# EAGLE schematic esp8266S_5A (EAGLE 7.5.0)
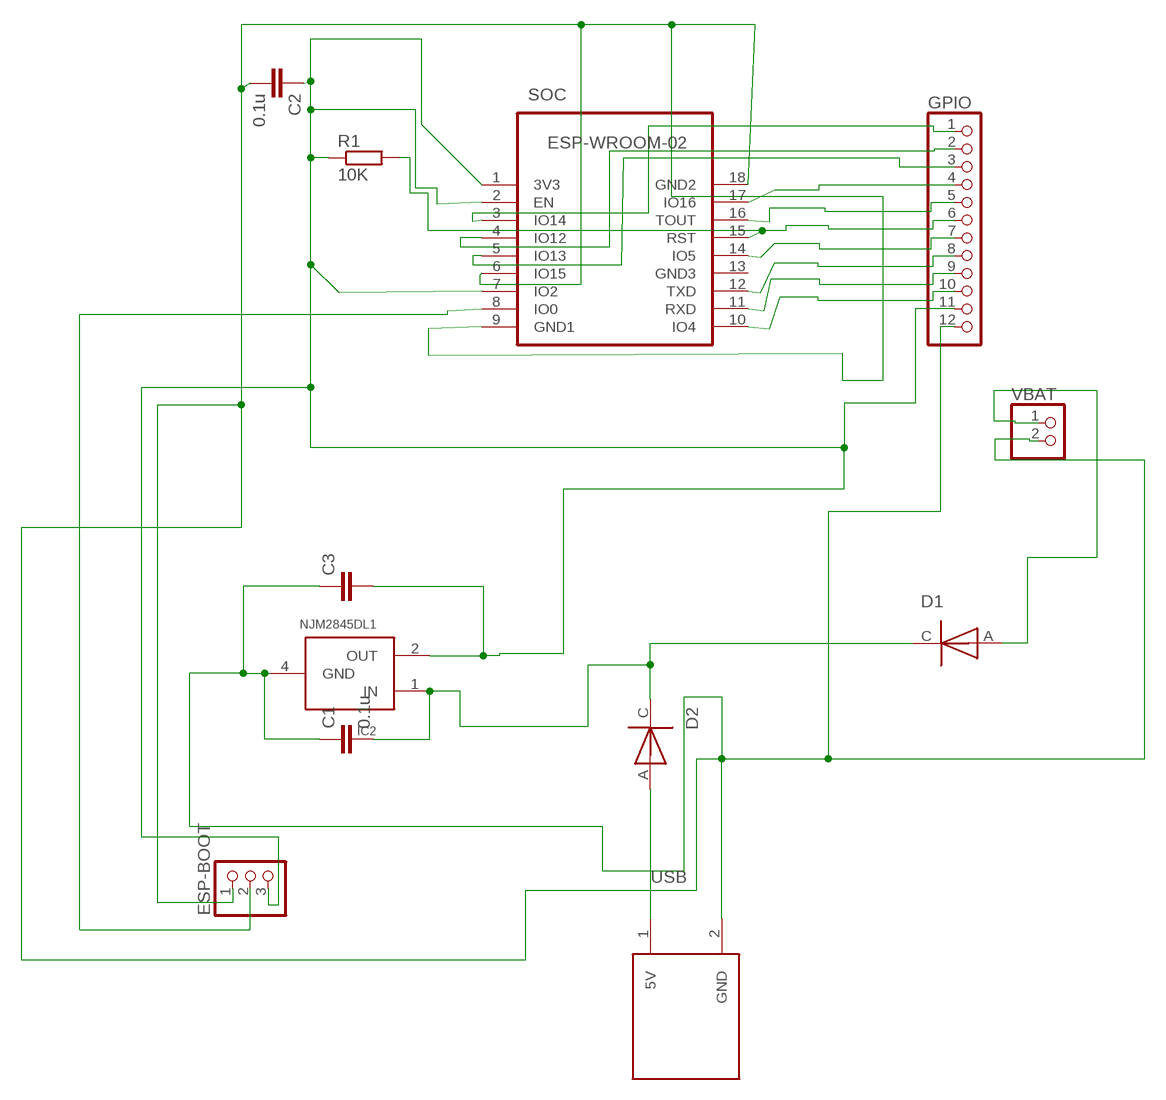
[diagram p0: schematic, sheet 1]

## Parts
C1  0.1u  C-EUC0603  [C0603]
C2  0.1u  C-EUC0603  [C0603]
C3  C-EUC1206  [C1206]
D1  DIODE-EX  [SOD80C]
D2  DIODE-EX  [SOD80C]
ESP-BOOT  PINHD-1X3  [1X03]
GPIO  PINHD-1X12  [1X12]
IC2  NJM2845DL1  [NJM2845DL1-PKG]
R1  10K  R-EU_R0603  [R0603]
SOC  ESP-WROOM-02  ESP-WROOM-02-CP2FRONT  [FRONT-FACE-CP2]
USB  USB-CUST-1  [USB-CUST-1-PKG]
VBAT  PINHD-1X2  [1X02]

## Nets
N$1: ESP-BOOT.2 SOC.8(IO0)
N$4: GPIO.1 SOC.3(IO14)
N$5: C1.2 D1.C D2.C IC2.1(IN)
N$6: GPIO.4 SOC.17(IO16)
N$7: GPIO.5 SOC.16(TOUT)
N$8: GPIO.7 SOC.14(IO5)
N$9: GPIO.8 SOC.12(TXD)
N$10: GPIO.9 SOC.11(RXD)
N$11: GPIO.10 SOC.10(IO4)
N$12: D2.A USB.1(5V)
N$13: GPIO.6 R1.2 SOC.15(RST)
N$14: C2.1 C3.2 ESP-BOOT.3 GPIO.11 IC2.2(OUT) R1.1 SOC.1(3V3) SOC.2(EN) SOC.7(IO2)
N$15: D1.A VBAT.1
N$16: GPIO.3 SOC.5(IO13)
N$17: GPIO.2 SOC.4(IO12)
N$19: C1.1 C2.2 C3.1 ESP-BOOT.1 GPIO.12 IC2.4(GND) SOC.6(IO15) SOC.9(GND1) SOC.18(GND2) USB.2(GND) VBAT.2
Unconnected: SOC.13(GND3)

## Library data of the parts
C1-C3 = resistor:C-EU: CAPACITOR, European symbol
D1 D2 = diode-ex2:DIODE-EX
ESP-BOOT = pinhead:PINHD-1X3: PIN HEADER
GPIO = pinhead:PINHD-1X12: PIN HEADER
IC2 = ic-cust-4:NJM2845DL1
R1 = resistor:R-EU_: RESISTOR, European symbol
SOC = esp-wroom-02-CP2:ESP-WROOM-02-CP2: WiFi module - ESP-WROOM-02
USB = usb-cust-2:USB-CUST-1
VBAT = pinhead:PINHD-1X2: PIN HEADER